# Altium schematic sheet Voltage_Current_Schem.SchDoc
size A; SheetNumber: 3; SheetTotal: 8
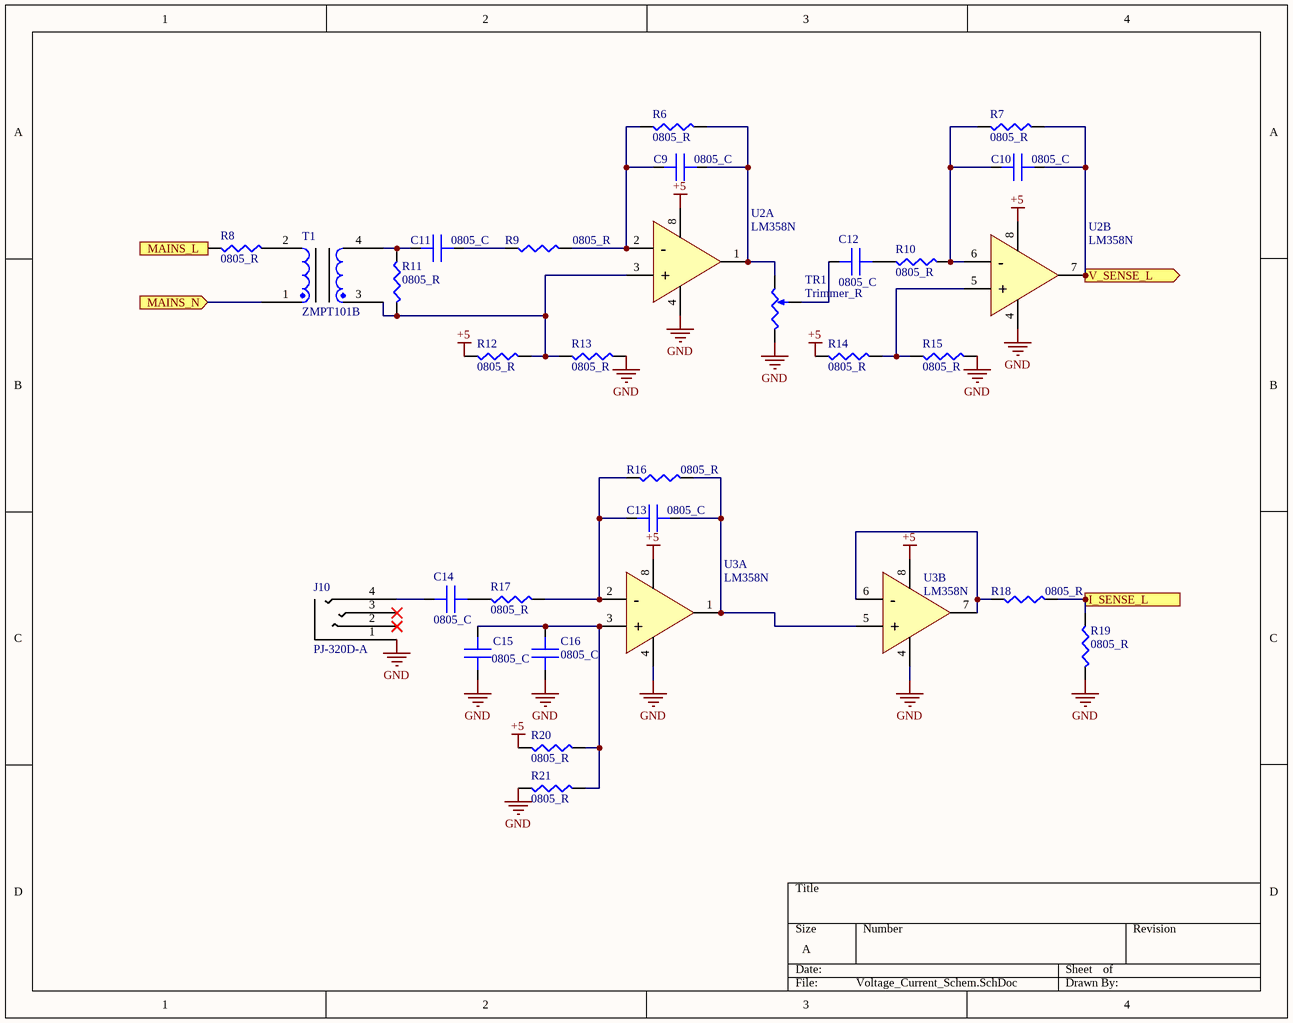
[diagram p0: Voltage_Current_Schem.SchDoc]

## Parts
C9  0805_C  [C0805 - 0.1uf]
C10  0805_C  [C0805 - 0.1uf]
C11  0805_C  [C0805 - 0.1uf]
C12  0805_C  [C0805 - 0.1uf]
C13  0805_C  [C0805 - 0.1uf]
C14  0805_C  [C0805 - 0.1uf]
C15  0805_C  [C0805 - 0.1uf]
C16  0805_C  [C0805 - 0.1uf]
J10  PJ-320D-A  [PJ-320D-A]
R6  0805_R  [R0805]
R7  0805_R  [R0805]
R8  0805_R  [R0805]
R9  0805_R  [R0805]
R10  0805_R  [R0805]
R11  0805_R  [R0805]
R12  0805_R  [R0805]
R13  0805_R  [R0805]
R14  0805_R  [R0805]
R15  0805_R  [R0805]
R16  0805_R  [R0805]
R17  0805_R  [R0805]
R18  0805_R  [R0805]
R19  0805_R  [R0805]
R20  0805_R  [R0805]
R21  0805_R  [R0805]
T1  ZMPT101B  [ZMPT101B]
TR1  Trimmer_R  [3296W_TRIMMER]
U2  LM358N  [SOP8]  (parts A,B of 2)
U3  LM358N  [SOP8]  (parts A,B of 2)

## Ports
I_SENSE_L (out), MAINS_L (in), MAINS_N (in), V_SENSE_L (out)

## Nets
+5: R12.1 R14.1 R20.2 U2.8(VCC) U3.8(VCC)
GND: C15.1 C16.1 J10.1 R13.2 R15.2 R19.2 R21.2 TR1.2 U2.4(VSS) U3.4(VSS)
I_SENSE_L: R18.1 R19.1 ; port I_SENSE_L
MAINS_L: R8.1 ; port MAINS_L
MAINS_N: T1.1 ; port MAINS_N
V_SENSE_L: C10.2 R7.2 U2.7(OUT1) ; port V_SENSE_L
NetC9_1: C9.1 R6.1 R9.2 U2.2(-)
NetC9_2: C9.2 R6.2 TR1.1 U2.1(OUT1)
NetC10_1: C10.1 R7.1 R10.2 U2.6(-)
NetC11_1: C11.1 R11.2 T1.4
NetC11_2: C11.2 R9.1
NetC12_1: C12.1 TR1.3
NetC12_2: C12.2 R10.1
NetC13_1: C13.1 R16.1 R17.1 U3.2(-)
NetC13_2: C13.2 R16.2 U3.1(OUT1) U3.5(+)
NetC14_1: C14.1 J10.4
NetC14_2: C14.2 R17.2
NetC15_2: C15.2 C16.2 R20.1 R21.1 U3.3(+)
NetR8_2: R8.2 T1.2
NetR11_1: R11.1 R12.2 R13.1 T1.3 U2.3(+)
NetR14_2: R14.2 R15.1 U2.5(+)
NetR18_2: R18.2 U3.6(-) U3.7(OUT1)

Not connected (* = marked no-connect by the designer): J10 2* 3*

## Library data of the parts
C9-C16 = 0805 Capacitor
R6-R21 = 0805 Resistor
TR1 = Blue Trimmer Pot (Small)